# Altium schematic sheet aLCD.SchDoc: aLCD
size A4; SheetNumber: 7; SheetTotal: 8
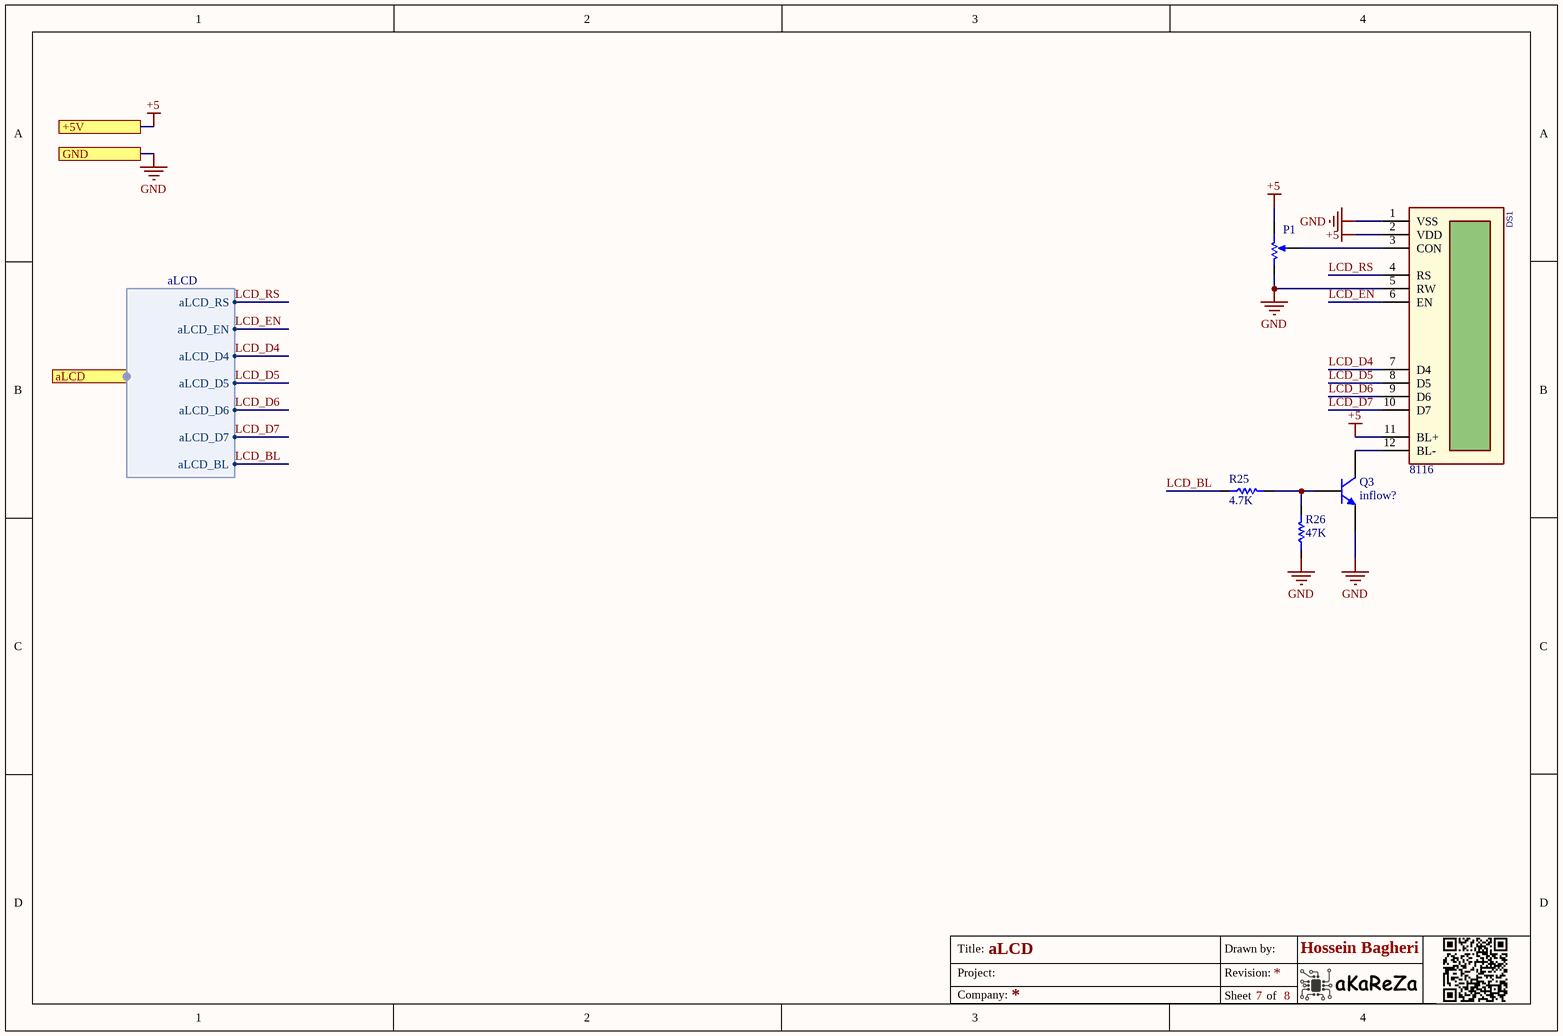
[diagram p0: aLCD.SchDoc]

## Parts
DS1  Inflow: 8116  [BOX-HDR-2x6-2.54mm-S]  (hidden comment: 16x2)
P1  10K  [Multi turn 01]  (value not drawn)
Q3  Inflow: inflow?  [SOT23_N]  (hidden comment: NPN)
R25  4.7K  [RES 0805 (2012X06L)]
R26  47K  [RES 0805 (2012X06L)]

## Ports
+5V, aLCD (harness aLCD), GND

## Harnesses
aLCD: aLCD_RS, aLCD_EN, aLCD_D4, aLCD_D5, aLCD_D6, aLCD_D7, aLCD_BL

## Nets
+5: DS1.2(VDD) DS1.11(BL+) P1.1 ; port +5V
GND: DS1.1(VSS) DS1.5(RW) P1.3 Q3.2(E) R26.1 ; port GND
LCD_BL: R25.1 ; port aLCD.aLCD_BL
LCD_D4: DS1.7(D4) ; port aLCD.aLCD_D4
LCD_D5: DS1.8(D5) ; port aLCD.aLCD_D5
LCD_D6: DS1.9(D6) ; port aLCD.aLCD_D6
LCD_D7: DS1.10(D7) ; port aLCD.aLCD_D7
LCD_EN: DS1.6(EN) ; port aLCD.aLCD_EN
LCD_RS: DS1.4(RS) ; port aLCD.aLCD_RS
NetDS1_3: DS1.3(CON) P1.2
NetDS1_12: DS1.12(BL-) Q3.3(C)
NetQ3_1: Q3.1(B) R25.2 R26.2

## Notes on the sheet
- Title:
- Project:
- Drawn by:
- Revision:
- Hossein Bagheri
- Company:
- Sheet
- of

## Library data of the parts
DS1 = ModSen_LCD_CH_16x2_Box: Alphanumeric LCD character; Rating: Rating?; Validation: Valid; Value: 16x2; Package: Dip; Type: Alphanumeric
P1 = Res_Multi: Multi Turn; Rating: Rating?; Validation: Valid; Inflow: inflow?; Package: Package?; Type: Type?; Value: 10K
Q3 = Semi_BJT_BC817: NPN General purpose Transistor; Rating: Rating?; Type: Type?; Validation: Valid; Value: NPN; Package: Package?
R25 R26 = Res_SMD_0805: Resistor; Inflow: inflow?; Rating: 0.125W; Validation: Valid; Package: 0805; Type: 10%
  R25: Value: 4.7K
  R26: Value: 47K